# EAGLE schematic hirose_omnetics_adapter_schematic_rev4 (EAGLE 7.2.0)
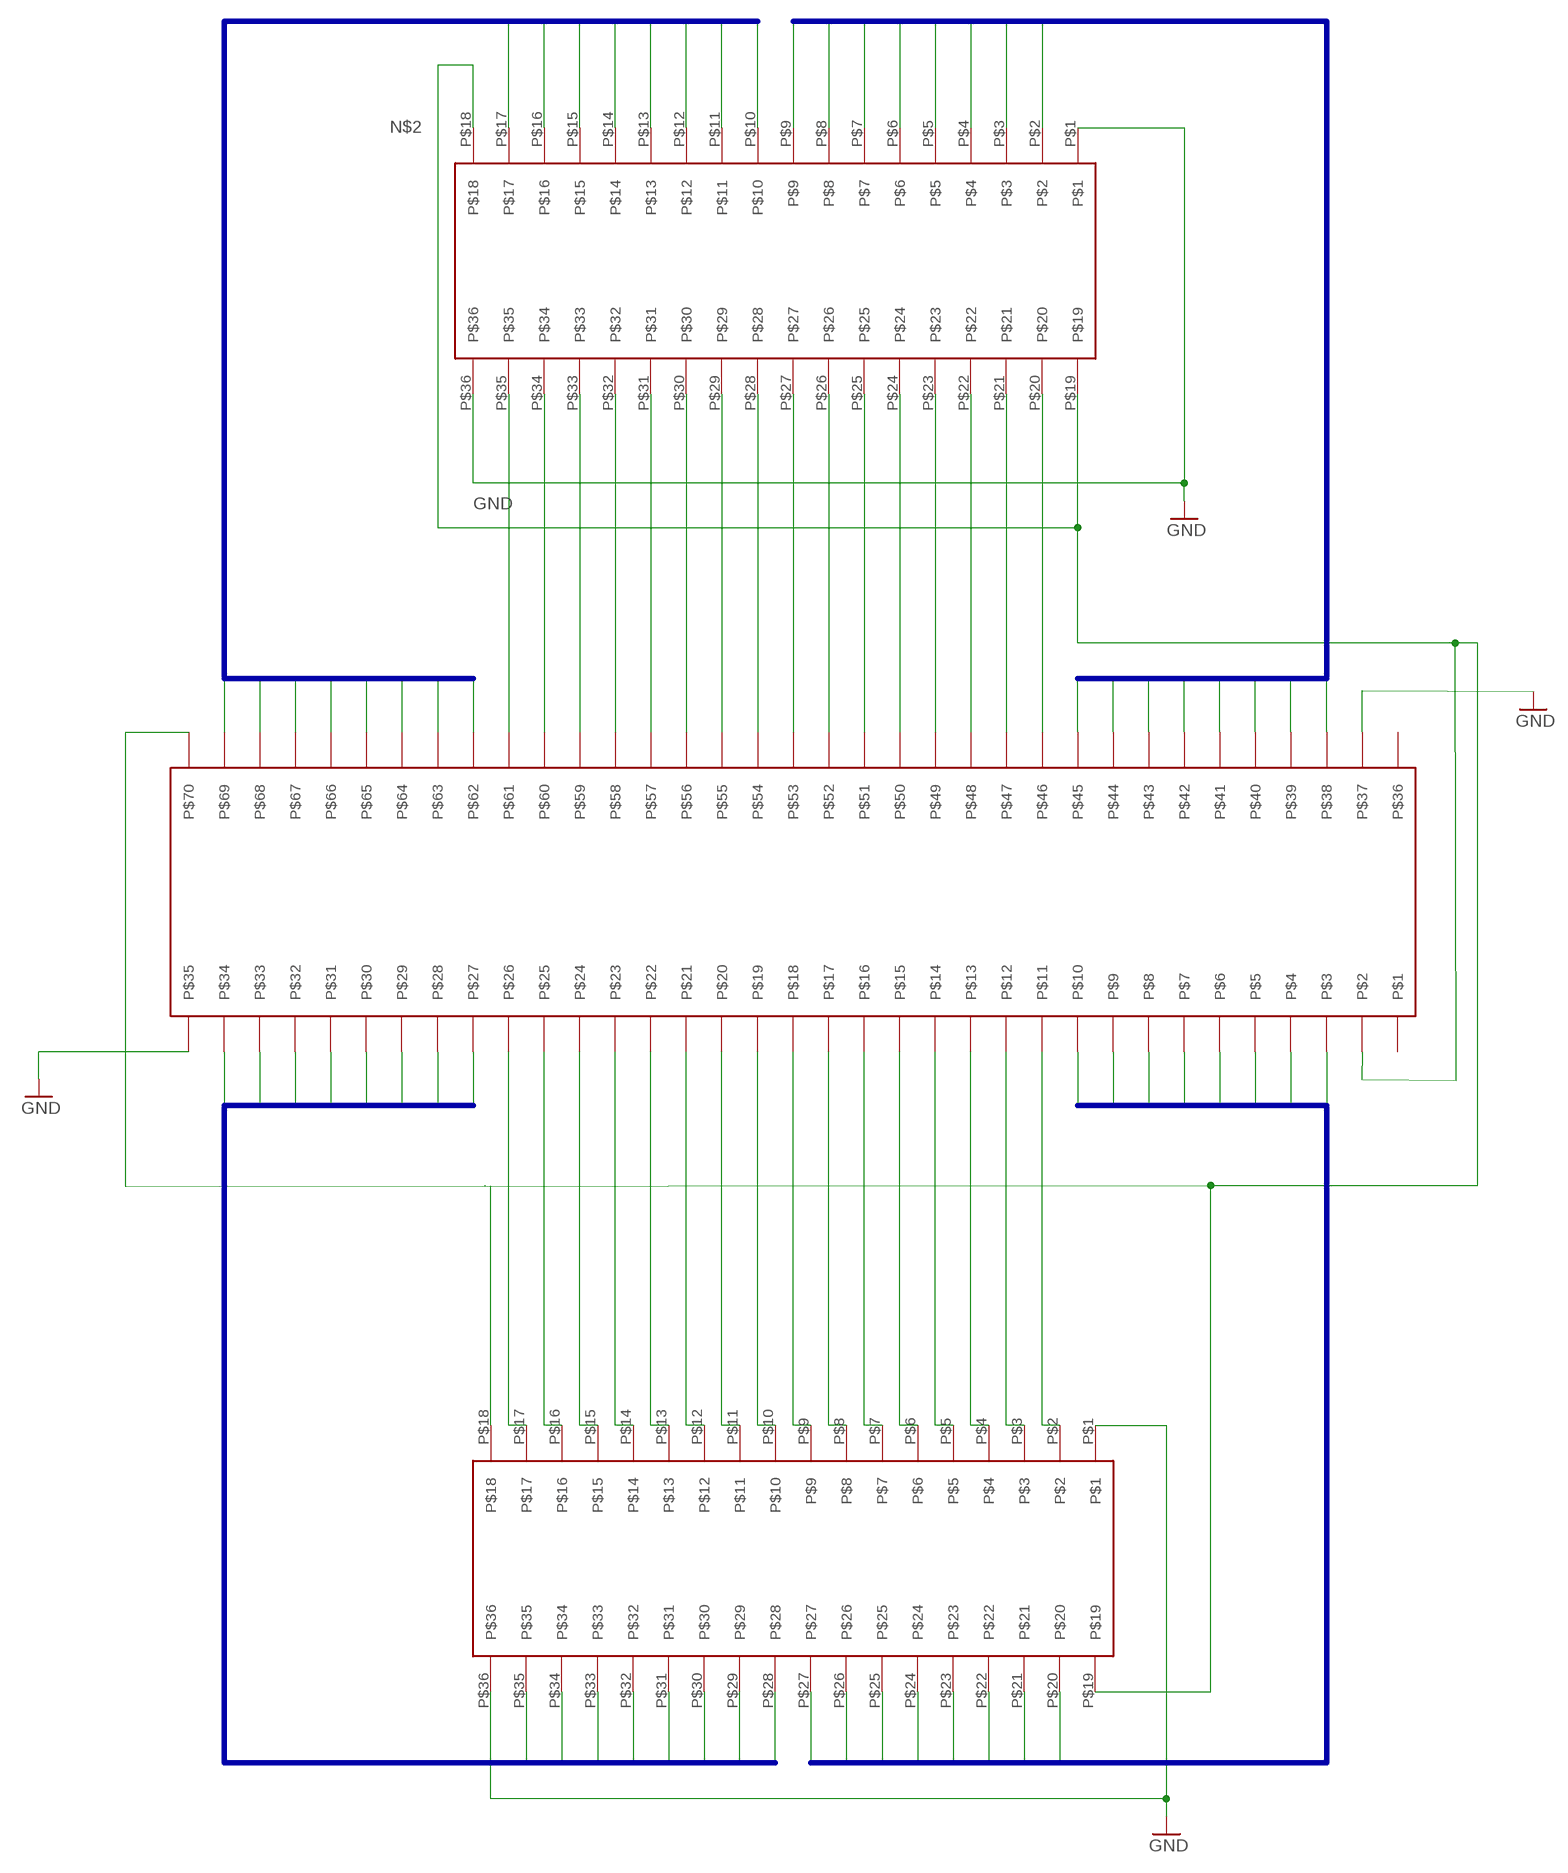
[diagram p0: schematic, sheet 1]

## Parts
U$1  HIROSE_DF40_70PIN  [HIROSE_DF40C-70DS]
U$2  OMNETICS_A79026  [OMNETICS_A79026-001]
U$3  OMNETICS_A79026  [OMNETICS_A79026-001]

## Nets
A0: U$1.P$62 U$2.P$10
A1: U$1.P$63 U$2.P$11
A2: U$1.P$64 U$2.P$12
A3: U$1.P$65 U$2.P$13
A4: U$1.P$66 U$2.P$14
A5: U$1.P$67 U$2.P$15
A6: U$1.P$68 U$2.P$16
A7: U$1.P$69 U$2.P$17
B0: U$1.P$45 U$2.P$9
B1: U$1.P$44 U$2.P$8
B2: U$1.P$43 U$2.P$7
B3: U$1.P$42 U$2.P$6
B4: U$1.P$41 U$2.P$5
B5: U$1.P$40 U$2.P$4
B6: U$1.P$39 U$2.P$3
B7: U$1.P$38 U$2.P$2
C0: U$1.P$27 U$3.P$28
C1: U$1.P$28 U$3.P$29
C2: U$1.P$29 U$3.P$30
C3: U$1.P$30 U$3.P$31
C4: U$1.P$31 U$3.P$32
C5: U$1.P$32 U$3.P$33
C6: U$1.P$33 U$3.P$34
C7: U$1.P$34 U$3.P$35
D0: U$1.P$10 U$3.P$27
D1: U$1.P$9 U$3.P$26
D2: U$1.P$8 U$3.P$25
D3: U$1.P$7 U$3.P$24
D4: U$1.P$6 U$3.P$23
D5: U$1.P$5 U$3.P$22
D6: U$1.P$4 U$3.P$21
D7: U$1.P$3 U$3.P$20
GND: U$1.P$35 U$1.P$37 U$2.P$1 U$2.P$36 U$3.P$1 U$3.P$36
N$1: U$1.P$61 U$2.P$35
N$2: U$1.P$2 U$1.P$70 U$2.P$18 U$2.P$19 U$3.P$18 U$3.P$19
N$3: U$1.P$60 U$2.P$34
N$4: U$1.P$59 U$2.P$33
N$5: U$1.P$58 U$2.P$32
N$6: U$1.P$57 U$2.P$31
N$7: U$1.P$56 U$2.P$30
N$8: U$1.P$55 U$2.P$29
N$9: U$1.P$54 U$2.P$28
N$10: U$1.P$53 U$2.P$27
N$11: U$1.P$52 U$2.P$26
N$12: U$1.P$51 U$2.P$25
N$13: U$1.P$50 U$2.P$24
N$14: U$1.P$49 U$2.P$23
N$15: U$1.P$48 U$2.P$22
N$16: U$1.P$47 U$2.P$21
N$17: U$1.P$46 U$2.P$20
N$18: U$1.P$26 U$3.P$17
N$19: U$1.P$25 U$3.P$16
N$20: U$1.P$24 U$3.P$15
N$21: U$1.P$23 U$3.P$14
N$22: U$1.P$22 U$3.P$13
N$23: U$1.P$21 U$3.P$12
N$24: U$1.P$20 U$3.P$11
N$25: U$1.P$19 U$3.P$10
N$26: U$1.P$18 U$3.P$9
N$27: U$1.P$17 U$3.P$8
N$28: U$1.P$16 U$3.P$7
N$29: U$1.P$15 U$3.P$6
N$30: U$1.P$14 U$3.P$5
N$31: U$1.P$13 U$3.P$4
N$32: U$1.P$12 U$3.P$3
N$33: U$1.P$11 U$3.P$2
Unconnected: U$1.P$1 U$1.P$36

## Buses
A[0..7]
B[0..7]
C[0..7]
D[0..7]

## Library data of the parts
U$1 = GG_hirose70:HIROSE_DF40_70PIN
U$2 U$3 = Omnetics_A79026-001:OMNETICS_A79026